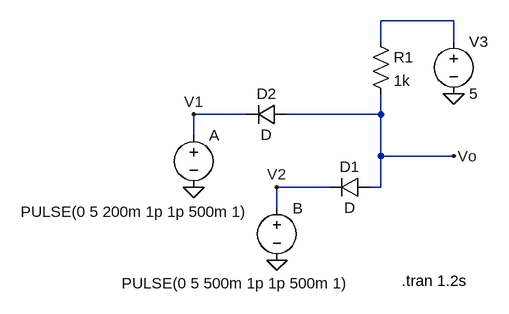
[diagram p0: schematic Punto6.asc]
Punto6.asc, the LTspice schematic file:
Version 4
SHEET 1 880 680
WIRE 352 -64 240 -64
WIRE 240 -32 240 -64
WIRE 352 -32 352 -64
WIRE 32 80 -48 80
WIRE 240 80 240 48
WIRE 240 80 96 80
WIRE -48 112 -48 80
WIRE 240 144 240 80
WIRE 352 144 240 144
WIRE 160 192 80 192
WIRE 240 192 240 144
WIRE 240 192 224 192
WIRE 80 224 80 192
FLAG 352 48 0
FLAG -48 192 0
FLAG 80 304 0
FLAG 352 144 Vo
FLAG -48 80 V1
FLAG 80 192 V2
SYMBOL voltage -48 96 R0
WINDOW 3 -266 134 Left 2
WINDOW 123 0 0 Left 0
WINDOW 39 0 0 Left 0
SYMATTR InstName A
SYMATTR Value PULSE(0 5 200m 1p 1p 500m 1)
SYMBOL voltage 80 208 R0
WINDOW 3 -239 132 Left 2
WINDOW 123 0 0 Left 0
WINDOW 39 0 0 Left 0
SYMATTR InstName B
SYMATTR Value PULSE(0 5 500m 1p 1p 500m 1)
SYMBOL diode 224 176 R90
WINDOW 0 0 32 VBottom 2
WINDOW 3 32 32 VTop 2
SYMATTR InstName D1
SYMBOL diode 96 64 R90
WINDOW 0 0 32 VBottom 2
WINDOW 3 32 32 VTop 2
SYMATTR InstName D2
SYMBOL res 224 -48 R0
SYMATTR InstName R1
SYMATTR Value 1k
SYMBOL voltage 352 -48 R0
SYMATTR InstName V3
SYMATTR Value 5
TEXT 272 336 Left 2 !.tran 1.2s

The netlist it stands for:
* Punto6.asc
V§A V1 0 PULSE(0 5 200m 1p 1p 500m 1)
V§B V2 0 PULSE(0 5 500m 1p 1p 500m 1)
D1 Vo V2 D
D2 Vo V1 D
R1 N001 Vo 1k
V3 N001 0 5
.model D D
.lib standard.dio
.tran 1.2s
.backanno
.end